# EAGLE design esp8266 (EAGLE 6.5.0)
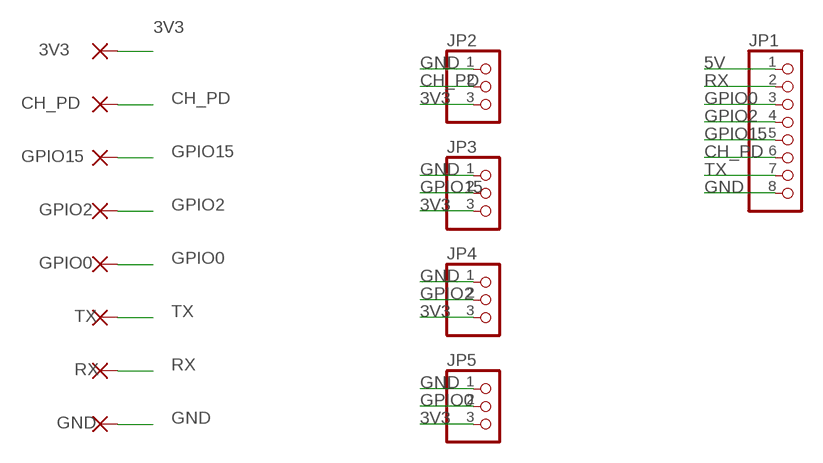
[diagram p0: schematic, sheet 1]

## Parts
3V3  1,6/0,9  [1,6/0,9]
CH_PD  1,6/0,9  [1,6/0,9]
GND  1,6/0,9  [1,6/0,9]
GPIO0  1,6/0,9  [1,6/0,9]
GPIO2  1,6/0,9  [1,6/0,9]
GPIO15  1,6/0,9  [1,6/0,9]
JP1  PINHD-1X8  [1X08]
JP2  PINHD-1X3  [1X03]
JP3  PINHD-1X3  [1X03]
JP4  PINHD-1X3  [1X03]
JP5  PINHD-1X3  [1X03]
RX  1,6/0,9  [1,6/0,9]
TX  1,6/0,9  [1,6/0,9]

## Nets
3V3: 3V3.1(P) JP2.3 JP3.3 JP4.3 JP5.3
5V: JP1.1
CH_PD: CH_PD.1(P) JP1.6 JP2.2
GND: GND.1(P) JP1.8 JP2.1 JP3.1 JP4.1 JP5.1
GPIO0: GPIO0.1(P) JP1.3 JP5.2
GPIO2: GPIO2.1(P) JP1.4 JP4.2
GPIO15: GPIO15.1(P) JP1.5 JP3.2
RX: JP1.2 RX.1(P)
TX: JP1.7 TX.1(P)

## Library data of the parts
3V3 CH_PD GND GPIO0 GPIO2 GPIO15 RX TX = wirepad:1,6/0,9: THROUGH-HOLE PAD
JP1 = pinhead:PINHD-1X8: PIN HEADER
JP2-JP5 = pinhead:PINHD-1X3: PIN HEADER

## Board
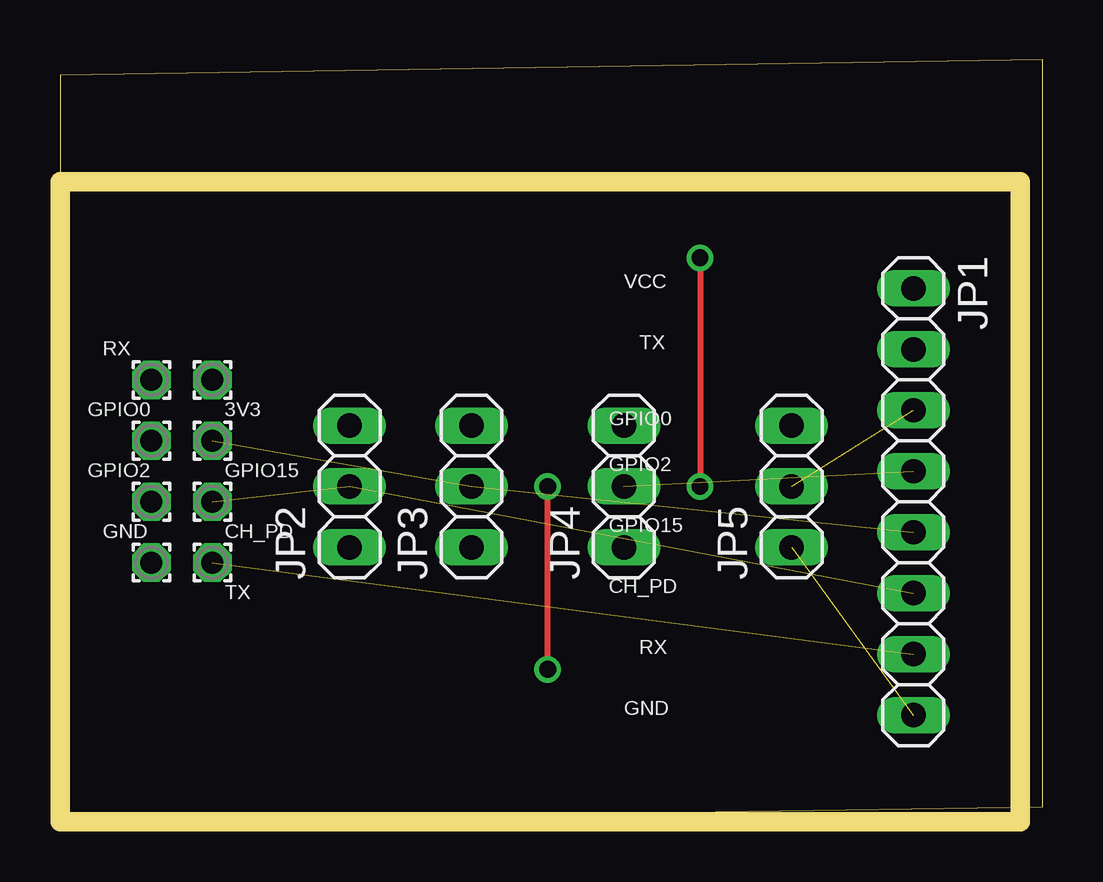
[diagram p1: board, top side]
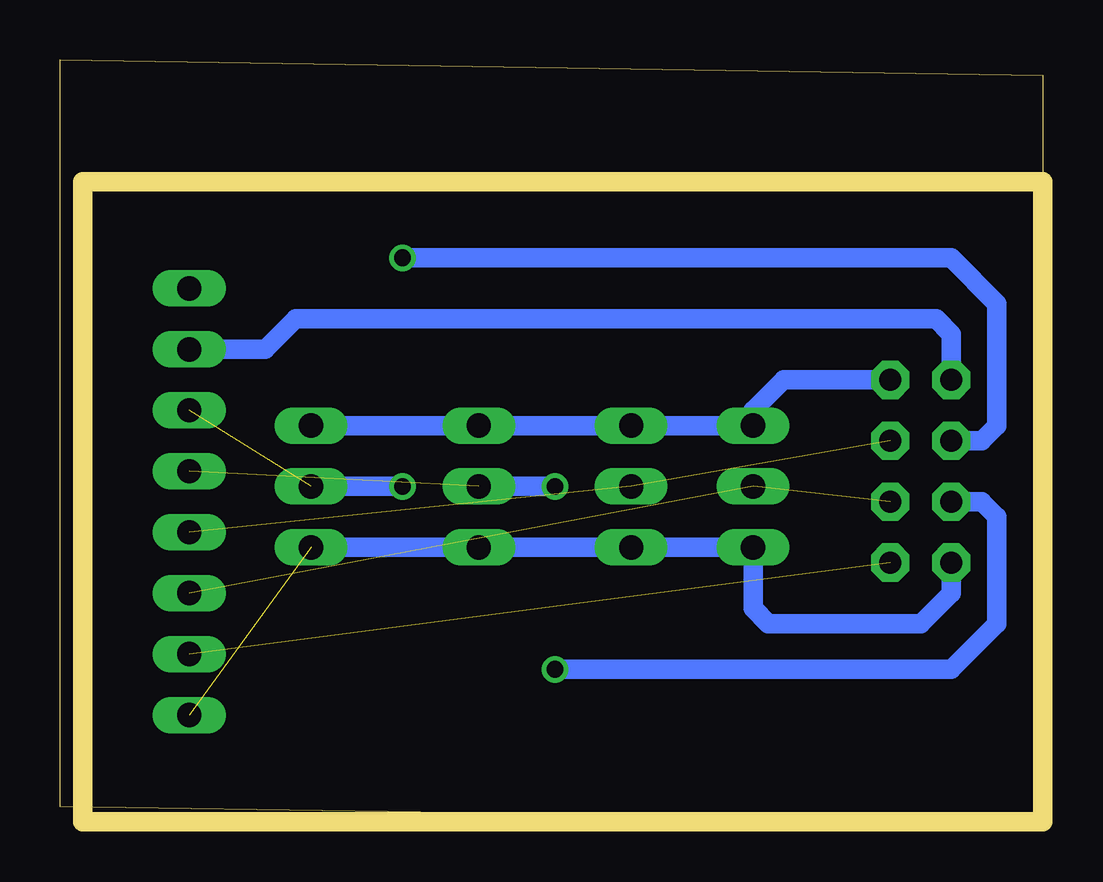
[diagram p2: board, bottom side, seen from below]

Size 40.95 x 31.74 mm. Coordinates in mm from the lower left corner, seen from the top.
Outline: 0,0 40.95,0.64 40.95,31.74 0,31.11 0,0
Copper layers (1*16): Top 0.035mm / dielectric 1.5mm / Bottom 0.035mm
Design rules "default": minimum track width 10mil, minimum drill 24mil, track to track 8mil, track to pad 8mil, pad to pad 8mil, via to via 8mil, smd to smd 8mil, copper to edge 40mil, drill to drill 8mil, minimum pad ring 10mil, minimum via ring 8mil, stop-mask expansion 4mil, vias tented up to drill 0mil, thermal gap 10mil
Milling: 4 lines

### Footprints (pad centres in the part's own frame; a part is rotated, then mirrored left to right if it is on the bottom)
1,6/0,9 = drill 0.914 pad 1.6 octagon: 1 0,0
1X08 = drill 1.016 long: 1 -8.89,0; 2 -6.35,0; 3 -3.81,0; 4 -1.27,0; 5 1.27,0; 6 3.81,0; 7 6.35,0; 8 8.89,0
1X03 = drill 1.016 long: 1 -2.54,0; 2 0,0; 3 2.54,0

### Placement (x,y rotation side)
3V3  6.35,18.41 0 top
CH_PD  6.35,13.34 0 top
GND  3.81,10.79 0 top
GPIO0  3.81,15.88 0 top
GPIO2  3.81,13.34 0 top
GPIO15  6.35,15.88 0 top
JP1  35.56,13.34 270 top
JP2  12.06,13.97 90 top
JP3  17.14,13.97 90 top
JP4  23.5,13.97 90 top
JP5  30.48,13.97 90 top
RX  3.81,18.41 0 top
TX  6.35,10.79 0 top

### Tracks (layer width: path | path; a pad name or v marks a point on that pad's centre or on a via)
3V3
  Bottom 0.813: JP5.3 JP4.3 JP3.3 JP2.3 12.06,17.14 10.79,18.41 3V3.1
CH_PD  (2 unrouted)
GND  (1 unrouted)
  Bottom 0.813: JP5.1 JP4.1 JP3.1 JP2.1 12.06,8.89 11.43,8.26 5.08,8.26 3.81,9.53 GND.1
GPIO0  (via drill 0.7)  (1 unrouted)
  Top 0.254: v26.67,23.5 v26.67,13.97
  Bottom 0.813: GPIO0.1 2.54,15.88 1.91,16.51 1.91,21.59 3.81,23.5 v26.67,23.5 | v26.67,13.97 JP5.2
GPIO2  (via drill 0.7)  (1 unrouted)
  Top 0.254: v20.32,6.35 v20.32,13.97
  Bottom 0.813: GPIO2.1 2.54,13.34 1.91,12.7 1.91,8.26 3.81,6.35 v20.32,6.35 | v20.32,13.97 JP4.2
GPIO15  (2 unrouted)
RX
  Bottom 0.813: RX.1 3.81,20.32 4.45,20.95 31.11,20.95 32.38,19.68 JP1.2
TX  (1 unrouted)

### Text on the board
tNames: VCC | TX | GPIO0 | GPIO2 | GPIO15 | CH_PD | RX | GND